# Altium project DCDC.PrjPcb (part 7 of 9)
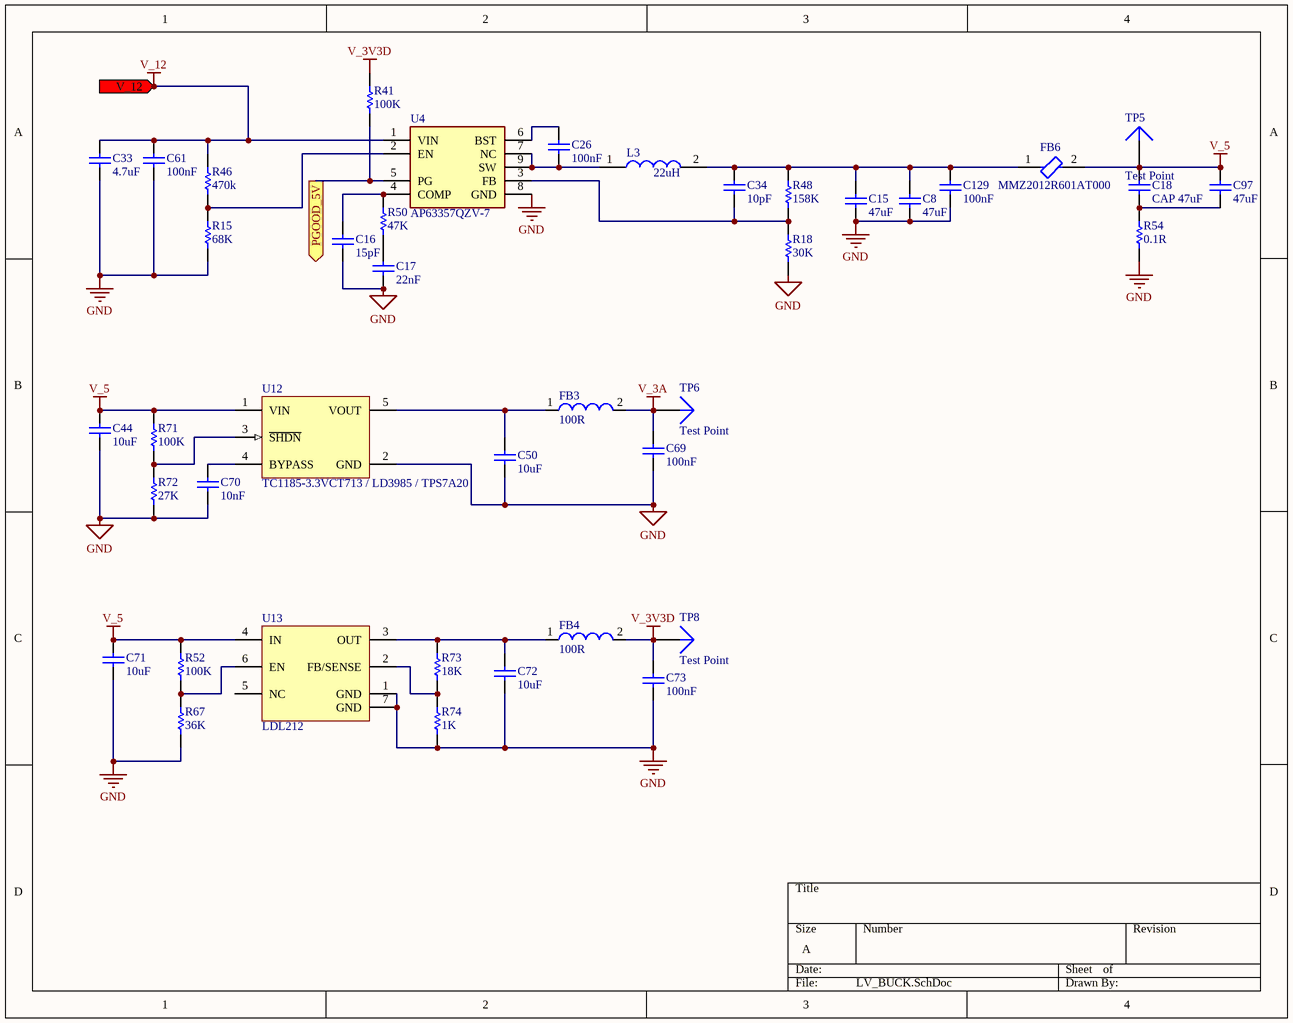
[diagram p13: LV_BUCK.SchDoc]

## Sheet LV_BUCK.SchDoc (continued)
### Library data of the parts
C8 C15 C97 = CAP: X5R 47uF ±20% 10V 1206 Multilayer Ceramic Capacitors MLCC - SMD/SMT ROHS; Manufacturer: Kyocera AVX; Manufacturer Part Number: 12066C226KAT2A; Tolerance: Â±10%; Case-EIA: 1206; Rated Voltage: 6.3 V; Value: 22uF; Case-Metric: 3216; Voltage Rating (DC): 6.3V; Dielectric: X7R; Dissipation Factor: 5%; Technology: SMT; Max Thickness: 1.9 mm; Supplier 1: Digi-Key; Supplier Part Number 1: 478-5997-1-ND; RoHS: Yes; Category: Ceramic Capacitors; Stock 1: 4915; Pricing 1: 1=0.81000, 10=0.57100, 100=0.37570, 500=0.27830, 1000=0.23656 (USD); Mount: Surface Mount; Case/Package: 1206; Number of Pins: 2; Case Code (Imperial): 1206; Case Code (Metric): 3216; Contact Plating: Tin,Matte; Min Operating Temperature: -55°C; Max Operating Temperature: 125°C; Capacitance: 47uF; Voltage Rating: 10V; Packaging: Tape and Reel; Package Quantity: 2500; Termination: SMD/SMT; Voltage: 6.3V; Length: 3.2mm; Height: 1.78mm; Width: 1.6mm; Depth: 1.6mm; Thickness: 0.07inch; Radiation Hardening: No; REACH SVHC: No SVHC; Lead Free: Lead Free; ComponentLink1URL: https://datasheet.ciiva.com/11786/0900766b80dc2409-11786266.pdf?src-supplier=RSComponents; ComponentLink1Description: https://datasheet.ciiva.com/11786/0900766b80dc2409-11786266.pdf?src-supplier=RSComponents; ComponentLink2URL: https://datasheet.ciiva.com/16315/cx7r-16315655.pdf?src-supplier=Future+Electronics; ComponentLink2Description: https://datasheet.ciiva.com/16315/cx7r-16315655.pdf?src-supplier=Future+Electronics; ComponentLink3URL: https://datasheet.ciiva.com/154/cx7r-154924.pdf?src-supplier=Digi-Key; ComponentLink3Description: https://datasheet.ciiva.com/154/cx7r-154924.pdf?src-supplier=Digi-Key; ComponentLink4URL: https://datasheet.ciiva.com/154/cx7r-154925.pdf?src-supplier=Digi-Key; ComponentLink4Description: https://datasheet.ciiva.com/154/cx7r-154925.pdf?src-supplier=Digi-Key; ComponentLink5URL: https://datasheet.ciiva.com/154/cx7r-154926.pdf?src-supplier=Digi-Key; ComponentLink5Description: https://datasheet.ciiva.com/154/cx7r-154926.pdf?src-supplier=Digi-Key; Parameter 1: *; JLCPCB Part #: C96123
C16 = CMP-1034-00812-2: C0G ±5% 15pF 50V 0402 Multilayer Ceramic Capacitors MLCC - SMD/SMT ROHS; Manufacturer: AVX Interconnect / Elco; Part Number: 04025A150FAT2A; Tolerance: 1%; Supplier 1: Digi-Key; Supplier Part Number 1: 478-5126-1-ND; Manufacturer Part Number: 04025A150FAT2A; RoHS: Yes; Category: Ceramic Capacitors; Stock 1: 101927; Pricing 1: 1=0.57000, 10=0.40100, 50=0.30300, 100=0.26390, 500=0.19550, 1000=0.16618, 2500=0.15640, 5000=0.14662 (USD); Mount: Surface Mount,PCB; Case/Package: 0402; Number of Pins: 2; Case Code (Metric): 1005; Case Code (Imperial): 0402; Dielectric Material: Ceramic; Min Operating Temperature: -55°C; Max Operating Temperature: 125°C; Package Quantity: 1; Capacitance: 15pF; Voltage Rating: 50V; Packaging: Tape and Reel; Voltage Rating (DC): 50V; Dielectric: C0G; Termination: SMD/SMT; Series: -; Construction: Flat; Voltage: 50V; Length: 1mm; Width: 0.02inch; Height: 0.56mm; Depth: 0.5mm; Thickness: 0.022inch; Radiation Hardening: No; REACH SVHC: No SVHC; Lead Free: Lead Free; RoHS Compliant: Yes; ComponentLink1URL: https://datasheet.ciiva.com/26927/getdatasheetpartid-379176-26927300.pdf?src-supplier=Verical; ComponentLink1Description: https://datasheet.ciiva.com/26927/getdatasheetpartid-379176-26927300.pdf?src-supplier=Verical; ComponentLink2URL: https://datasheet.ciiva.com/157/ccog-157986.pdf?src-supplier=Digi-Key; ComponentLink2Description: https://datasheet.ciiva.com/157/ccog-157986.pdf?src-supplier=Digi-Key; ComponentLink3URL: https://datasheet.ciiva.com/157/ccog-157987.pdf?src-supplier=Digi-Key; ComponentLink3Description: https://datasheet.ciiva.com/157/ccog-157987.pdf?src-supplier=Digi-Key; ComponentLink4URL: https://datasheet.ciiva.com/157/ccog-157988.pdf?src-supplier=Digi-Key; ComponentLink4Description: https://datasheet.ciiva.com/157/ccog-157988.pdf?src-supplier=Digi-Key; ComponentLink5URL: https://datasheet.ciiva.com/14603/70001039-14603477.pdf?src-supplier=Allied+Electronics; ComponentLink5Description: https://datasheet.ciiva.com/14603/70001039-14603477.pdf?src-supplier=Allied+Electronics; ComponentLink6URL: https://datasheet.ciiva.com/28453/1796416-28453769.pdf?src-supplier=Element14; ComponentLink6Description: https://datasheet.ciiva.com/28453/1796416-28453769.pdf?src-supplier=Element14; ComponentLink7URL: https://datasheet.ciiva.com/22619/1796416-22619722.pdf?src-supplier=Element14; ComponentLink7Description: https://datasheet.ciiva.com/22619/1796416-22619722.pdf?src-supplier=Element14; ComponentLink8URL: https://datasheet.ciiva.com/11568/ccog-11568587.pdf?src-supplier=Avnet; ComponentLink8Description: https://datasheet.ciiva.com/11568/ccog-11568587.pdf?src-supplier=Avnet; Parameter 1: *; JLCPCB Part #: C1548
C17 = CMP-2008-02925-1: X7R ±10% 50V 22nF 0402 Multilayer Ceramic Capacitors MLCC - SMD/SMT ROHS; Manufacturer: AVX Interconnect / Elco; Part Number: 04023C103JAT2A; Tolerance: 5%; Capacitance: 10nF; Voltage Rating: 25V; Supplier 1: Digi-Key; Supplier Part Number 1: 478-7867-1-ND; Manufacturer Part Number: 04023C103JAT2A; RoHS: Yes; Category: Ceramic Capacitors; Stock 1: 9321; Pricing 1: 1=0.35000, 10=0.24300, 50=0.16980, 100=0.14560, 500=0.10920, 1000=0.09221, 2500=0.08735, 5000=0.08250 (USD); Mount: Surface Mount; Case/Package: 0402; Number of Pins: 2; Case Code (Imperial): 0402; Case Code (Metric): 1005; Min Operating Temperature: -55°C; Max Operating Temperature: 125°C; Packaging: Tape and Reel; Package Quantity: 1; Voltage Rating (DC): 25V; Dielectric: X7R; Termination: SMD/SMT; Series: -; Construction: Flat; Length: 1mm; Width: 0.5mm; Thickness: 0.022inch; Depth: 0.5mm; Radiation Hardening: No; RoHS Compliant: Yes; Lead Free: Lead Free; ComponentLink1URL: https://datasheet.ciiva.com/11499/cx7r-11499815.pdf?src-supplier=Avnet; ComponentLink1Description: https://datasheet.ciiva.com/11499/cx7r-11499815.pdf?src-supplier=Avnet; ComponentLink2URL: https://datasheet.ciiva.com/5424/cx7r-218113-5424201.pdf?src-supplier=Mouser; ComponentLink2Description: https://datasheet.ciiva.com/5424/cx7r-218113-5424201.pdf?src-supplier=Mouser; ComponentLink3URL: https://datasheet.ciiva.com/7614/cx7r-7614730.pdf?src-supplier=Digi-Key; ComponentLink3Description: https://datasheet.ciiva.com/7614/cx7r-7614730.pdf?src-supplier=Digi-Key; ComponentLink4URL: https://datasheet.ciiva.com/208/cx7r-208205.pdf?src-supplier=Digi-Key; ComponentLink4Description: https://datasheet.ciiva.com/208/cx7r-208205.pdf?src-supplier=Digi-Key; ComponentLink5URL: https://datasheet.ciiva.com/14906/cx7r-14906237.pdf?src-supplier=Digi-Key; ComponentLink5Description: https://datasheet.ciiva.com/14906/cx7r-14906237.pdf?src-supplier=Digi-Key; ComponentLink6URL: https://datasheet.ciiva.com/16397/cx7r-16397645.pdf?src-supplier=Future+Electronics; ComponentLink6Description: https://datasheet.ciiva.com/16397/cx7r-16397645.pdf?src-supplier=Future+Electronics; ComponentLink7URL: https://datasheet.ciiva.com/14906/cx7r-14906238.pdf?src-supplier=Digi-Key; ComponentLink7Description: https://datasheet.ciiva.com/14906/cx7r-14906238.pdf?src-supplier=Digi-Key; Parameter 1: *; JLCPCB Part #: C1532
C18 = CMP-1038-02291-1: CAP 47uF 6.3V ±20% 1210 (3225 Metric) Thickness 2.8mm SMD; Tolerance: Â±20%; Case-EIA: 1210; Case-Metric: 3225; Technology: SMT; Rated Voltage: 6.3 V; Max Thickness: 2.8 mm; Value: 47uF; Parameter 1: *; JLCPCB Part #: *
C26 = CMP-2008-02800-1: X7R 100nF ±10% 16V 0402 Multilayer Ceramic Capacitors MLCC - SMD/SMT ROHS; Manufacturer: AVX Interconnect / Elco; Part Number: 0402YC104KAT2A; Supplier 1: Digi-Key; Supplier Part Number 1: 478-7888-1-ND; Manufacturer Part Number: 0402YC104KAT2A; RoHS: Yes; Category: Ceramic Capacitors; Stock 1: 72315; Pricing 1: 1=0.10000, 10=0.01600, 50=0.00860, 100=0.00700, 500=0.00500, 1000=0.00393, 2500=0.00358, 5000=0.00329 (USD); Mount: Surface Mount,PCB; Case/Package: 0402; Case Code (Metric): 1005; Case Code (Imperial): 0402; Dielectric Material: Ceramic; Contact Plating: Tin,Matte; Min Operating Temperature: -55°C; Max Operating Temperature: 125°C; Tolerance: 10%; Packaging: Tape and Reel; Capacitance: 100nF; Voltage Rating: 16V; Voltage Rating (DC): 16V; Dielectric: X7R; Voltage: 16V; Package Quantity: 1; Termination: SMD/SMT; Series: -; Construction: Flat; Length: 1mm; Width: 0.02inch; Height: 0.56mm; Thickness: 0.022inch; Depth: 0.5mm; Radiation Hardening: No; REACH SVHC: Unknown; RoHS Compliant: Yes; Lead Free: Lead Free; ComponentLink1URL: https://datasheet.ciiva.com/1123/1679506-1123956.pdf?src-supplier=Element14; ComponentLink1Description: https://datasheet.ciiva.com/1123/1679506-1123956.pdf?src-supplier=Element14; ComponentLink2URL: https://datasheet.ciiva.com/7614/cx7r-7614662.pdf?src-supplier=Digi-Key; ComponentLink2Description: https://datasheet.ciiva.com/7614/cx7r-7614662.pdf?src-supplier=Digi-Key; ComponentLink3URL: https://datasheet.ciiva.com/22693/1679506-22693578.pdf?src-supplier=Element14; ComponentLink3Description: https://datasheet.ciiva.com/22693/1679506-22693578.pdf?src-supplier=Element14; ComponentLink4URL: https://datasheet.ciiva.com/16623/cx7r-16623291.pdf?src-supplier=Avnet+Europe; ComponentLink4Description: https://datasheet.ciiva.com/16623/cx7r-16623291.pdf?src-supplier=Avnet+Europe; ComponentLink5URL: https://datasheet.ciiva.com/2987/cx7r-2987708.pdf?src-supplier=Avnet; ComponentLink5Description: https://datasheet.ciiva.com/2987/cx7r-2987708.pdf?src-supplier=Avnet; ComponentLink6URL: https://datasheet.ciiva.com/6265/cx7r-6265276.pdf?src-supplier=Digi-Key; ComponentLink6Description: https://datasheet.ciiva.com/6265/cx7r-6265276.pdf?src-supplier=Digi-Key; ComponentLink7URL: https://datasheet.ciiva.com/28613/1679506-28613260.pdf?src-supplier=Element14; ComponentLink7Description: https://datasheet.ciiva.com/28613/1679506-28613260.pdf?src-supplier=Element14; ComponentLink8URL: https://datasheet.ciiva.com/5411/cx7r-218113-5411197.pdf?src-supplier=Mouser; ComponentLink8Description: https://datasheet.ciiva.com/5411/cx7r-218113-5411197.pdf?src-supplier=Mouser; ComponentLink9URL: https://datasheet.ciiva.com/7709/1679506-7709566.pdf?src-supplier=Element14; ComponentLink9Description: https://datasheet.ciiva.com/7709/1679506-7709566.pdf?src-supplier=Element14; Parameter 1: *; JLCPCB Part #: C1525
C33 = CMP-2000-07581-1: X7R ±10% 50V 4.7uF 1206 Multilayer Ceramic Capacitors MLCC - SMD/SMT ROHS; Manufacturer: AVX; Manufacturer Part Number: 12065C475KAT2A; Case\/Package: 1206; Dissipation Factor: 2.5%; Case Code (Imperial): 1206; Tolerance: 10%; Radiation Hardening: No; Mount: SurfaceMount; Capacitance: 4.7uF; Voltage Rating: 50V; Width: 1.6mm; Manufacturer URL: http://www.avx.com/; RoHSCompliant: True; Thickness: 0.07inch; Depth: 1.6mm; Min Operating Temperature: -55degC; Package Reference: 1206; Voltage Rating (DC): 50V; Package Description: 2-Pin Surface Mount Device, Body 3.2 x 1.6 mm; Datasheet URL: http://datasheets.avx.com/X7RDielectric.pdf; Case Code (Metric): 3216; REACH SVHC: NoSVHC; Packaging: TapeandReel; Mounting Technology: SurfaceMount; Termination: SMD/SMT; Package Quantity: 1; Datasheet Version: 03/2017; Max Operating Temperature: 125degC; Contact Plating: Matte; Length: 3.2mm; Lead Free: LeadFree; Dielectric: X7R; Supplier 1: Digi-Key; Supplier Part Number 1: 478-6653-1-ND; RoHS: Yes; Category: Ceramic Capacitors; Stock 1: 241833; Pricing 1: 1=0.51000, 10=0.35400, 100=0.21250, 500=0.15940, 1000=0.13460 (USD); Case/Package: 1206; ComponentLink1URL: https://datasheet.ciiva.com/5410/cx7r-218113-5410549.pdf?src-supplier=Mouser; ComponentLink1Description: https://datasheet.ciiva.com/5410/cx7r-218113-5410549.pdf?src-supplier=Mouser; ComponentLink2URL: https://datasheet.ciiva.com/16387/flexiterm-16387141.pdf?src-supplier=Future+Electronics; ComponentLink2Description: https://datasheet.ciiva.com/16387/flexiterm-16387141.pdf?src-supplier=Future+Electronics; ComponentLink3URL: https://datasheet.ciiva.com/153/cx7r-153750.pdf?src-supplier=Digi-Key; ComponentLink3Description: https://datasheet.ciiva.com/153/cx7r-153750.pdf?src-supplier=Digi-Key; ComponentLink4URL: https://datasheet.ciiva.com/7833/cx7r-7833462.pdf?src-supplier=Element14; ComponentLink4Description: https://datasheet.ciiva.com/7833/cx7r-7833462.pdf?src-supplier=Element14; ComponentLink5URL: https://datasheet.ciiva.com/153/cx7r-153751.pdf?src-supplier=Digi-Key; ComponentLink5Description: https://datasheet.ciiva.com/153/cx7r-153751.pdf?src-supplier=Digi-Key; ComponentLink6URL: https://datasheet.ciiva.com/7833/cx7r-7833463.pdf?src-supplier=Element14; ComponentLink6Description: https://datasheet.ciiva.com/7833/cx7r-7833463.pdf?src-supplier=Element14; ComponentLink7URL: https://datasheet.ciiva.com/153/cx7r-153752.pdf?src-supplier=Digi-Key; ComponentLink7Description: https://datasheet.ciiva.com/153/cx7r-153752.pdf?src-supplier=Digi-Key; Parameter 1: *; JLCPCB Part #: C29823
C34 = CMP-2008-02563-1: C0G ±5% 10pF 50V 0402 Multilayer Ceramic Capacitors MLCC - SMD/SMT ROHS; Part Number: 04025A100DAT2A; Manufacturer: AVX Interconnect / Elco; Temperature Coefficient: 30ppm/°C; Supplier 1: Digi-Key; Supplier Part Number 1: 478-7870-1-ND; Manufacturer Part Number: 04025A100DAT2A; RoHS: Yes; Category: Ceramic Capacitors; Stock 1: 172687; Pricing 1: 1=0.30000, 10=0.20700, 50=0.13800, 100=0.11730, 500=0.08280, 1000=0.07245, 2500=0.06900, 5000=0.06382 (USD); Mount: Surface Mount; Case/Package: 0402; Number of Pins: 2; Case Code (Metric): 1005; Case Code (Imperial): 0402; Dielectric Material: Ceramic; Contact Plating: Tin,Matte; Min Operating Temperature: -55°C; Max Operating Temperature: 125°C; Capacitance: 10pF; Voltage Rating: 50V; Voltage Rating (DC): 50V; Package Quantity: 1; Packaging: Tape and Reel; Dielectric: C0G; Termination: SMD/SMT; Series: -; Tolerance: 5%; Construction: Flat; Voltage: 50V; Length: 1mm; Width: 0.02inch; Height: 0.56mm; Depth: 0.5mm; Thickness: 0.022inch; Radiation Hardening: No; RoHS Compliant: Yes; REACH SVHC: No SVHC; Lead Free: Lead Free; ComponentLink1URL: https://datasheet.ciiva.com/11788/0900766b80def0e2-11788539.pdf?src-supplier=RSComponents; ComponentLink1Description: https://datasheet.ciiva.com/11788/0900766b80def0e2-11788539.pdf?src-supplier=RSComponents; ComponentLink2URL: https://datasheet.ciiva.com/2990/ccog-2990165.pdf?src-supplier=Avnet; ComponentLink2Description: https://datasheet.ciiva.com/2990/ccog-2990165.pdf?src-supplier=Avnet; ComponentLink3URL: https://datasheet.ciiva.com/16623/ccog-16623350.pdf?src-supplier=Avnet+Europe; ComponentLink3Description: https://datasheet.ciiva.com/16623/ccog-16623350.pdf?src-supplier=Avnet+Europe; ComponentLink4URL: https://datasheet.ciiva.com/14906/ccog-14906265.pdf?src-supplier=Digi-Key; ComponentLink4Description: https://datasheet.ciiva.com/14906/ccog-14906265.pdf?src-supplier=Digi-Key; ComponentLink5URL: https://datasheet.ciiva.com/206/ccog-206459.pdf?src-supplier=Digi-Key; ComponentLink5Description: https://datasheet.ciiva.com/206/ccog-206459.pdf?src-supplier=Digi-Key; ComponentLink6URL: https://datasheet.ciiva.com/14906/ccog-14906267.pdf?src-supplier=Digi-Key; ComponentLink6Description: https://datasheet.ciiva.com/14906/ccog-14906267.pdf?src-supplier=Digi-Key; ComponentLink7URL: https://datasheet.ciiva.com/1123/ccog-1123468.pdf?src-supplier=Element14; ComponentLink7Description: https://datasheet.ciiva.com/1123/ccog-1123468.pdf?src-supplier=Element14; ComponentLink8URL: https://datasheet.ciiva.com/1123/ccog-1123469.pdf?src-supplier=Element14; ComponentLink8Description: https://datasheet.ciiva.com/1123/ccog-1123469.pdf?src-supplier=Element14; Parameter 1: *; JLCPCB Part #: C32949
C44 C50 C71 C72 = CMP-2007-03395-1: X5R 25V ±10% 10uF 0805 Multilayer Ceramic Capacitors MLCC - SMD/SMT ROHS; Part Number: GRM21BR71A106KE51L; Manufacturer: Murata; Parameter 1: *; JLCPCB Part #: C15850
C61 C69 C73 = CAP: X7R 100nF ±10% 50V 0603 Multilayer Ceramic Capacitors MLCC - SMD/SMT ROHS; Part Number: GCM188R72A104KA64D; Manufacturer: Murata; Manufacturer Part Number: CC0603KRX7R9BB104; Voltage Rating: 100V; Supplier 1: Arrow Electronics; Supplier Part Number 1: GCM188R72A104KA64D; RoHS: Yes; Category: Ceramic Capacitors; Mount: Surface Mount; Case/Package: 0603; Case Code (Imperial): 0603; Case Code (Metric): 1608; Min Operating Temperature: -55°C; Max Operating Temperature: 125°C; Tolerance: 10%; Packaging: Tape and Reel; Capacitance: 100nF; Dielectric: X7R; Termination: SMD/SMT; Voltage Rating (DC): 100V; Length: 1.6mm; Height: 0.8mm; Depth: 0.8mm; Radiation Hardening: No; ComponentLink1URL: https://datasheet.ciiva.com/17451/product-17451047.pdf?src-supplier=Avnet+Europe; ComponentLink1Description: https://datasheet.ciiva.com/17451/product-17451047.pdf?src-supplier=Avnet+Europe; ComponentLink2URL: https://datasheet.ciiva.com/26889/getdatasheetpartid-387765-26889164.pdf?src-supplier=Verical; ComponentLink2Description: https://datasheet.ciiva.com/26889/getdatasheetpartid-387765-26889164.pdf?src-supplier=Verical; Parameter 1: *; JLCPCB Part #: C14663
C70 = CMP-2006-02924-1: X7R ±10% 50V 10nF 0603 Multilayer Ceramic Capacitors MLCC - SMD/SMT ROHS; Part Number: GRM188R71H472KA01D; Manufacturer: Murata; Capacitance: 4.7nF; Insulation Resistance: 10GR; Supplier 1: Farnell; Supplier Part Number 1: 1118177; Manufacturer Part Number: GRM188R71H472KA01D; RoHS: Yes; Category: Ceramic Capacitors; Pricing 1: 1=19.92000, 3=19.13000 (GBP); Mount: Surface Mount; Case/Package: 0603; Number of Pins: 2; Case Code (Imperial): 0603; Case Code (Metric): 1608; Dielectric Material: Ceramic; Material: Ceramic; Min Operating Temperature: -55°C; Max Operating Temperature: 125°C; Voltage Rating (DC): 50V; Tolerance: 10%; Packaging: Tape and Reel; Dielectric: X7R; Series: GRM; Voltage Rating: 50V; Package Quantity: 1; Termination: SMD/SMT; Voltage: 50V; Length: 1.6mm; Width: 0.8mm; Height: 0.8mm; Depth: 0.8mm; Thickness: 0.035inch; Radiation Hardening: No; RoHS Compliant: Yes; REACH SVHC: No SVHC; Lead Free: Lead Free; ComponentLink1URL: https://datasheet.ciiva.com/5412/product-5412608.pdf?src-supplier=Mouser; ComponentLink1Description: https://datasheet.ciiva.com/5412/product-5412608.pdf?src-supplier=Mouser; ComponentLink2URL: https://datasheet.ciiva.com/18102/getdatasheetpartid-75298-18102657.pdf?src-supplier=Verical; ComponentLink2Description: https://datasheet.ciiva.com/18102/getdatasheetpartid-75298-18102657.pdf?src-supplier=Verical; ComponentLink3URL: https://datasheet.ciiva.com/11787/0900766b8003061f-11787116.pdf?src-supplier=RSComponents; ComponentLink3Description: https://datasheet.ciiva.com/11787/0900766b8003061f-11787116.pdf?src-supplier=RSComponents; ComponentLink4URL: https://datasheet.ciiva.com/29201/451888-da-01-en-vs-kondensator-0603-29201828.pdf?src-supplier=Conrad; ComponentLink4Description: https://datasheet.ciiva.com/29201/451888-da-01-en-vs-kondensator-0603-29201828.pdf?src-supplier=Conrad; ComponentLink5URL: https://datasheet.ciiva.com/7937/4360-7937669.pdf?src-supplier=Element14; ComponentLink5Description: https://datasheet.ciiva.com/7937/4360-7937669.pdf?src-supplier=Element14; ComponentLink6URL: https://datasheet.ciiva.com/48428/nmgrm-data-en-48428597.pdf?src-supplier=Distrelec; ComponentLink6Description: https://datasheet.ciiva.com/48428/nmgrm-data-en-48428597.pdf?src-supplier=Distrelec; ComponentLink7URL: https://datasheet.ciiva.com/7937/4360-7937670.pdf?src-supplier=Element14; ComponentLink7Description: https://datasheet.ciiva.com/7937/4360-7937670.pdf?src-supplier=Element14; ComponentLink8URL: https://datasheet.ciiva.com/7937/4360-7937671.pdf?src-supplier=Element14; ComponentLink8Description: https://datasheet.ciiva.com/7937/4360-7937671.pdf?src-supplier=Element14; ComponentLink9URL: https://datasheet.ciiva.com/130/partnumbering-e-01-130733.pdf?src-supplier=Digi-Key; ComponentLink9Description: https://datasheet.ciiva.com/130/partnumbering-e-01-130733.pdf?src-supplier=Digi-Key; ComponentLink10URL: https://datasheet.ciiva.com/130/partnumbering-e-01-130734.pdf?src-supplier=Digi-Key; ComponentLink10Description: https://datasheet.ciiva.com/130/partnumbering-e-01-130734.pdf?src-supplier=Digi-Key; ComponentLink11URL: https://datasheet.ciiva.com/130/partnumbering-e-01-130735.pdf?src-supplier=Digi-Key; ComponentLink11Description: https://datasheet.ciiva.com/130/partnumbering-e-01-130735.pdf?src-supplier=Digi-Key; JLCPCB Part #: C57112
C129 = CAP: X7R 100nF ±10% 16V 0402 Multilayer Ceramic Capacitors MLCC - SMD/SMT ROHS; Manufacturer: AVX Interconnect / Elco; Part Number: 04026D104KAT2A; Voltage Rating: 6.3V; Dielectric: X5R; Supplier 1: Newark; Supplier Part Number 1: 34M9214; Manufacturer Part Number: 04026D104KAT2A; RoHS: Yes; Category: Ceramic Capacitors; Stock 1: 1436; Pricing 1: 10=0.02800, 25=0.02300, 50=0.01800, 100=0.01200, 250=0.01100, 500=0.00900, 1000=0.00700 (USD); Mount: Surface Mount; Case/Package: 0402; Case Code (Metric): 1005; Case Code (Imperial): 0402; Contact Plating: Tin,Matte; Dielectric Material: Ceramic; Min Operating Temperature: -55°C; Max Operating Temperature: 85°C; Package Quantity: 1; Packaging: Tape and Reel; Capacitance: 100nF; Tolerance: 10%; Voltage Rating (DC): 6.3V; Voltage: 6.3V; Termination: SMD/SMT; Series: -; Construction: Flat; Length: 1mm; Width: 0.02inch; Height: 0.56mm; Thickness: 0.022inch; Depth: 0.5mm; Radiation Hardening: No; REACH SVHC: No SVHC; Lead Free: Lead Free; RoHS Compliant: Yes; Parameter 1: *; JLCPCB Part #: C1525
FB3 FB4 = CMP-0220-00115-1: SMD EMI Suppression Ferrite Bead WE-CBF, Z = 1500 Ohm; DatasheetVersion: Dec-2005; ComponentLink1URL: http://www.we-online.com; PackageVersion: 2009; PackageDescription: Chip Inductor, 2-Leads, Body 1.6 x 0.8 mm; ComponentLink2URL: http://www.we-online.de/katalog/media/pdf/742792691.pdf; ComponentLink1Description: Manufacturer Link; ComponentLink2Description: Datasheet; Impedance: 1500 Ohm; PackageReference: SMD-0603; Parameter 1: *; JLCPCB Part #: *
FB6 = CMP-08257-000163-1: Signal Line Ferrite Bead 600Ω @ 100Mhz 500mA DCR 200mΩ SMD 0805; DC Resistance (DCR): 200mR; Tolerance: 25%; Impedance: 600R; Case/Package: 0805; Max DC Current: 500mA; RoHS Compliant: Yes; Mount: Surface Mount; Current Rating: 500mA; Case Code (Metric): 2012; Number of Pins: 2; Package Quantity: 1; Series: MMZ; Packaging: Cut Tape; Depth: 1.25mm; Width: 0.049inch; Length: 0.079inch; Case Code (Imperial): 0805; Height: 0.041inch; Core Material: Ferrite; REACH SVHC: No SVHC; Parameter 1: *; JLCPCB Part #: *
L3 = MPX1D0840L470: Inductor 22uH; Manufacturer_Name: Kemet; Manufacturer_Part_Number: MPX1D0840L220; Datasheet Link: https://componentsearchengine.com/Datasheets/1/MPX1D0840L470.pdf; Height: 4mm; Mouser Part Number: 80-MPX1D0840L220; Mouser Price/Stock: https://www.mouser.com/Search/Refine.aspx?Keyword=80-MPX1D0840L470; Parameter 1: *; JLCPCB Part #: *
R15 = CMP-2002-00968-1: 1/16W ±1% ±100ppm/℃ 68kΩ 0402 Chip Resistor - Surface Mount ROHS; Part Number: ERJ-2RKF4993X; Manufacturer: Panasonic; Resistance: 499kR; Temperature Coefficient: 100ppm/°C; Power Rating: 100mW; Voltage Rating: 50V; Supplier 1: Digi-Key; Supplier Part Number 1: P499KLCT-ND; Manufacturer Part Number: ERJ-2RKF4993X; RoHS: Yes; Category: Chip SMD Resistors; Stock 1: 131008; Pricing 1: 1=0.10000, 10=0.04000, 100=0.01620, 1000=0.00729, 2500=0.00632, 5000=0.00523 (USD); Mount: Surface Mount; Case/Package: 0402; Weight: 2.8E-05oz; Case Code (Imperial): 0402; Case Code (Metric): 1005; Contact Plating: Tin; Min Operating Temperature: -55°C; Max Operating Temperature: 155°C; Tolerance: 1%; Packaging: Tape and Reel; Composition: Thick Film; Package Quantity: 1; Termination: SMD/SMT; Number of Terminations: 2; Max Power Dissipation: 100mW; Voltage Rating (DC): 50V; Features: Automotive AEC-Q200; Military Standard: Not; Length: 1mm; Height: 0.016inch; Width: 0.5mm; Depth: 0.5mm; Lead Free: Lead Free; REACH SVHC: Unknown; ComponentLink1URL: https://datasheet.ciiva.com/28610/1678782-28610966.pdf?src-supplier=Element14; ComponentLink1Description: https://datasheet.ciiva.com/28610/1678782-28610966.pdf?src-supplier=Element14; ComponentLink2URL: https://datasheet.ciiva.com/24163/aoa0000ce2-24163576.pdf?src-supplier=Mouser; ComponentLink2Description: https://datasheet.ciiva.com/24163/aoa0000ce2-24163576.pdf?src-supplier=Mouser; ComponentLink3URL: https://datasheet.ciiva.com/9181/aoa0000ce2-9181513.pdf?src-supplier=Avnet; ComponentLink3Description: https://datasheet.ciiva.com/9181/aoa0000ce2-9181513.pdf?src-supplier=Avnet; ComponentLink4URL: https://datasheet.ciiva.com/5951/426256-5951322.pdf?src-supplier=Farnell; ComponentLink4Description: https://datasheet.ciiva.com/5951/426256-5951322.pdf?src-supplier=Farnell; ComponentLink5URL: https://datasheet.ciiva.com/43460/426256-43460346.pdf?src-supplier=Farnell; ComponentLink5Description: https://datasheet.ciiva.com/43460/426256-43460346.pdf?src-supplier=Farnell; ComponentLink6URL: https://datasheet.ciiva.com/9181/aoa0000ce2-9181509.pdf?src-supplier=Avnet; ComponentLink6Description: https://datasheet.ciiva.com/9181/aoa0000ce2-9181509.pdf?src-supplier=Avnet; ComponentLink7URL: https://datasheet.ciiva.com/28672/1678782-28672345.pdf?src-supplier=Element14; ComponentLink7Description: https://datasheet.ciiva.com/28672/1678782-28672345.pdf?src-supplier=Element14; ComponentLink8URL: https://datasheet.ciiva.com/46377/426256-46377753.pdf?src-supplier=Element14; ComponentLink8Description: https://datasheet.ciiva.com/46377/426256-46377753.pdf?src-supplier=Element14; ComponentLink9URL: https://datasheet.ciiva.com/16760/70260748-16760715.pdf?src-supplier=Allied+Electronics; ComponentLink9Description: https://datasheet.ciiva.com/16760/70260748-16760715.pdf?src-supplier=Allied+Electronics; Parameter 1: *; JLCPCB Part #: C36871
R18 = CMP-1011-00675-2: Res Thick Film 0402 30K Ohm 1% 0.063W(1/16W) ±100ppm/C Molded SMD Automotive Paper T/R; Part Number: CRCW040230K0FKED; Manufacturer: Vishay Dale; Resistance: 30kR; Power Rating: 63mW; Temperature Coefficient: 100ppm/°C; Voltage Rating: 50V; Supplier 1: RSComponents; Supplier Part Number 1: 6789140; Manufacturer Part Number: CRCW040230K0FKED; RoHS: Yes; Category: Chip SMD Resistors; Stock 1: 19350; Pricing 1: 50=0.04000, 500=0.01600, 1250=0.00800 (USD); Mount: Surface Mount; Case/Package: 0402; Number of Pins: 2; Case Code (Imperial): 0402; Case Code (Metric): 1005; Weight: 2.3E-05oz; Contact Plating: Tin; Size Code: 0402; Min Operating Temperature: -55°C; Max Operating Temperature: 155°C; Tolerance: 1%; Packaging: Tape and Reel; Resistor Type: Thick Film; Number of Terminations: 2; Series: CRCW; Max Power Dissipation: 63mW; Voltage Rating (DC): 50V; Package Quantity: 10000; Termination: SMD/SMT; Construction: Rectangular; Resistance Tolerance: 1%; Features: Automotive AEC-Q200; Technology: THICK FILM; Length: 1mm; Width: 0.5mm; Height: 0.35mm; Depth: 0.5mm; Radiation Hardening: No; RoHS Compliant: Yes; Military Standard: Not; Lead Free: Lead Free; REACH SVHC: Unknown; ComponentLink1URL: https://datasheet.ciiva.com/11811/0900766b80d98824-11811264.pdf?src-supplier=RSComponents; ComponentLink1Description: https://datasheet.ciiva.com/11811/0900766b80d98824-11811264.pdf?src-supplier=RSComponents; ComponentLink2URL: https://datasheet.ciiva.com/7673/1697337-7673253.pdf?src-supplier=Element14; ComponentLink2Description: https://datasheet.ciiva.com/7673/1697337-7673253.pdf?src-supplier=Element14; ComponentLink3URL: https://datasheet.ciiva.com/2464/dcrcwe3-2464534.pdf?src-supplier=Digi-Key; ComponentLink3Description: https://datasheet.ciiva.com/2464/dcrcwe3-2464534.pdf?src-supplier=Digi-Key; ComponentLink4URL: https://datasheet.ciiva.com/7673/1697337-7673254.pdf?src-supplier=Element14; ComponentLink4Description: https://datasheet.ciiva.com/7673/1697337-7673254.pdf?src-supplier=Element14; ComponentLink5URL: https://datasheet.ciiva.com/2464/dcrcwe3-2464535.pdf?src-supplier=Digi-Key; ComponentLink5Description: https://datasheet.ciiva.com/2464/dcrcwe3-2464535.pdf?src-supplier=Digi-Key; ComponentLink6URL: https://datasheet.ciiva.com/2464/dcrcwe3-2464536.pdf?src-supplier=Digi-Key; ComponentLink6Description: https://datasheet.ciiva.com/2464/dcrcwe3-2464536.pdf?src-supplier=Digi-Key; ComponentLink7URL: https://datasheet.ciiva.com/16886/dcrcwe3-16886248.pdf?src-supplier=Avnet+Europe; ComponentLink7Description: https://datasheet.ciiva.com/16886/dcrcwe3-16886248.pdf?src-supplier=Avnet+Europe; ComponentLink8URL: https://datasheet.ciiva.com/3256/dcrcwe3-3256380.pdf?src-supplier=Avnet; ComponentLink8Description: https://datasheet.ciiva.com/3256/dcrcwe3-3256380.pdf?src-supplier=Avnet; ComponentLink9URL: https://datasheet.ciiva.com/22702/1697337-22702876.pdf?src-supplier=Element14; ComponentLink9Description: https://datasheet.ciiva.com/22702/1697337-22702876.pdf?src-supplier=Element14; ComponentLink10URL: https://datasheet.ciiva.com/16784/70201119-16784286.pdf?src-supplier=Allied+Electronics; ComponentLink10Description: https://datasheet.ciiva.com/16784/70201119-16784286.pdf?src-supplier=Allied+Electronics; Parameter 1: *; JLCPCB Part #: *
R41 = CMP-2002-07343-1: 1/16W ±1% ±100ppm/℃ 100kΩ 0402 Chip Resistor - Surface Mount ROHS; Part Number: RC0402FR-07100KL; Manufacturer: Yageo / Phycomp; Power Rating: 63mW; Resistance: 100kR; Temperature Coefficient: 100ppm/°C; Voltage Rating: 50V; Supplier 1: Digi-Key; Supplier Part Number 1: 311-100KLRCT-ND; Manufacturer Part Number: RC0402FR-07100KL; RoHS: Yes; Category: Chip SMD Resistors; Stock 1: 17727422; Pricing 1: 1=0.10000, 10=0.01600, 100=0.00640, 1000=0.00286, 2500=0.00248, 5000=0.00205 (USD); Case/Package: 0402; Case Code (Metric): 1005; Case Code (Imperial): 0402; Min Operating Temperature: -55°C; Max Operating Temperature: 155°C; Tolerance: 1%; Packaging: Tape and Reel; Max Power Dissipation: 63mW; Series: RC; Package Quantity: 1; Termination: SMD/SMT; Resistance Tolerance: 1%; Resistor Type: Thick Film; Number of Terminations: 2; Construction: Rectangular; Features: Moisture Resistant; Technology: THICK FILM; Working Voltage: 50V; Length: 0.039inch; Width: 0.02inch; Height: 0.016inch; Depth: 0.5mm; RoHS Compliant: Yes; REACH SVHC: No SVHC; Military Standard: Not; Lead Free: Lead Free; ComponentLink1URL: https://datasheet.ciiva.com/11819/0900766b80c66297-11819452.pdf?src-supplier=RSComponents; ComponentLink1Description: https://datasheet.ciiva.com/11819/0900766b80c66297-11819452.pdf?src-supplier=RSComponents; ComponentLink2URL: https://datasheet.ciiva.com/2453/pyu-r-int-thick-7-2453361.pdf?src-supplier=Digi-Key; ComponentLink2Description: https://datasheet.ciiva.com/2453/pyu-r-int-thick-7-2453361.pdf?src-supplier=Digi-Key; ComponentLink3URL: https://datasheet.ciiva.com/2453/pyu-r-int-thick-7-2453362.pdf?src-supplier=Digi-Key; ComponentLink3Description: https://datasheet.ciiva.com/2453/pyu-r-int-thick-7-2453362.pdf?src-supplier=Digi-Key; ComponentLink4URL: https://datasheet.ciiva.com/2453/pyu-r-int-thick-7-2453363.pdf?src-supplier=Digi-Key; ComponentLink4Description: https://datasheet.ciiva.com/2453/pyu-r-int-thick-7-2453363.pdf?src-supplier=Digi-Key; ComponentLink5URL: https://datasheet.ciiva.com/22747/1018594-22747509.pdf?src-supplier=Element14; ComponentLink5Description: https://datasheet.ciiva.com/22747/1018594-22747509.pdf?src-supplier=Element14; ComponentLink6URL: https://datasheet.ciiva.com/15189/getdatasheetpartid-323696-15189334.pdf?src-supplier=Verical; ComponentLink6Description: https://datasheet.ciiva.com/15189/getdatasheetpartid-323696-15189334.pdf?src-supplier=Verical; ComponentLink7URL: https://datasheet.ciiva.com/12667/pyu-rc0402-51-rohs-l-6-r-12667930.pdf?src-supplier=Mouser; ComponentLink7Description: https://datasheet.ciiva.com/12667/pyu-rc0402-51-rohs-l-6-r-12667930.pdf?src-supplier=Mouser; Parameter 1: *; JLCPCB Part #: C25741
R46 = CMP-2002-00968-1: ±1% 1/16W 470kΩ ±100ppm/℃ 0402 Chip Resistor - Surface Mount ROHS; Part Number: ERJ-2RKF4993X; Manufacturer: Panasonic; Resistance: 499kR; Temperature Coefficient: 100ppm/°C; Power Rating: 100mW; Voltage Rating: 50V; Supplier 1: Digi-Key; Supplier Part Number 1: P499KLCT-ND; Manufacturer Part Number: ERJ-2RKF4993X; RoHS: Yes; Category: Chip SMD Resistors; Stock 1: 131008; Pricing 1: 1=0.10000, 10=0.04000, 100=0.01620, 1000=0.00729, 2500=0.00632, 5000=0.00523 (USD); Mount: Surface Mount; Case/Package: 0402; Weight: 2.8E-05oz; Case Code (Imperial): 0402; Case Code (Metric): 1005; Contact Plating: Tin; Min Operating Temperature: -55°C; Max Operating Temperature: 155°C; Tolerance: 1%; Packaging: Tape and Reel; Composition: Thick Film; Package Quantity: 1; Termination: SMD/SMT; Number of Terminations: 2; Max Power Dissipation: 100mW; Voltage Rating (DC): 50V; Features: Automotive AEC-Q200; Military Standard: Not; Length: 1mm; Height: 0.016inch; Width: 0.5mm; Depth: 0.5mm; Lead Free: Lead Free; REACH SVHC: Unknown; ComponentLink1URL: https://datasheet.ciiva.com/28610/1678782-28610966.pdf?src-supplier=Element14; ComponentLink1Description: https://datasheet.ciiva.com/28610/1678782-28610966.pdf?src-supplier=Element14; ComponentLink2URL: https://datasheet.ciiva.com/24163/aoa0000ce2-24163576.pdf?src-supplier=Mouser; ComponentLink2Description: https://datasheet.ciiva.com/24163/aoa0000ce2-24163576.pdf?src-supplier=Mouser; ComponentLink3URL: https://datasheet.ciiva.com/9181/aoa0000ce2-9181513.pdf?src-supplier=Avnet; ComponentLink3Description: https://datasheet.ciiva.com/9181/aoa0000ce2-9181513.pdf?src-supplier=Avnet; ComponentLink4URL: https://datasheet.ciiva.com/5951/426256-5951322.pdf?src-supplier=Farnell; ComponentLink4Description: https://datasheet.ciiva.com/5951/426256-5951322.pdf?src-supplier=Farnell; ComponentLink5URL: https://datasheet.ciiva.com/43460/426256-43460346.pdf?src-supplier=Farnell; ComponentLink5Description: https://datasheet.ciiva.com/43460/426256-43460346.pdf?src-supplier=Farnell; ComponentLink6URL: https://datasheet.ciiva.com/9181/aoa0000ce2-9181509.pdf?src-supplier=Avnet; ComponentLink6Description: https://datasheet.ciiva.com/9181/aoa0000ce2-9181509.pdf?src-supplier=Avnet; ComponentLink7URL: https://datasheet.ciiva.com/28672/1678782-28672345.pdf?src-supplier=Element14; ComponentLink7Description: https://datasheet.ciiva.com/28672/1678782-28672345.pdf?src-supplier=Element14; ComponentLink8URL: https://datasheet.ciiva.com/46377/426256-46377753.pdf?src-supplier=Element14; ComponentLink8Description: https://datasheet.ciiva.com/46377/426256-46377753.pdf?src-supplier=Element14; ComponentLink9URL: https://datasheet.ciiva.com/16760/70260748-16760715.pdf?src-supplier=Allied+Electronics; ComponentLink9Description: https://datasheet.ciiva.com/16760/70260748-16760715.pdf?src-supplier=Allied+Electronics; Parameter 1: *; JLCPCB Part #: C25790
R48 = CMP-2002-00386-1: RES SMD 158K OHM 1% 1/16W 0402; Manufacturer: Vishay Dale; Part Number: CRCW0402158KFKTD; Resistance: 158kR; Temperature Coefficient: 100ppm/°C; Power Rating: 63mW; Voltage Rating: 50V; Supplier 1: Avnet; Supplier Part Number 1: CRCW0402158KFKTD; Manufacturer Part Number: CRCW0402158KFKTD; RoHS: No; Category: Chip SMD Resistors; Stock 1: 10000; Pricing 1: 10000=0.02620, 20000=0.02556, 40000=0.02520, 60000=0.02448, 80000=0.02394, 100000=0.02340, 1000000=0.02286 (USD); Case/Package: 0402; Number of Pins: 2; Case Code (Metric): 1005; Case Code (Imperial): 0402; Contact Plating: Tin,Lead; Weight: 2.3E-05oz; Min Operating Temperature: -55°C; Max Operating Temperature: 155°C; Packaging: Tape and Reel; Tolerance: 1%; Resistor Type: Thick Film; Package Quantity: 10000; Number of Terminations: 2; Termination: SMD/SMT; Max Power Dissipation: 63mW; Series: CRCW; Voltage Rating (DC): 50V; Features: Automotive AEC-Q200; Resistance Tolerance: 1%; Length: 0.039inch; Width: 0.02inch; Height: 0.016inch; Radiation Hardening: No; RoHS Compliant: No; Lead Free: Contains Lead; REACH SVHC: Unknown; ComponentLink1URL: https://datasheet.ciiva.com/8967/dcrcw-8967692.pdf?src-supplier=Avnet; ComponentLink1Description: https://datasheet.ciiva.com/8967/dcrcw-8967692.pdf?src-supplier=Avnet; ComponentLink2URL: https://datasheet.ciiva.com/2563/dcrcw-2563087.pdf?src-supplier=Digi-Key; ComponentLink2Description: https://datasheet.ciiva.com/2563/dcrcw-2563087.pdf?src-supplier=Digi-Key; Parameter 1: *; JLCPCB Part #: *
R50 = CMP-2002-08626-1: 1/16W ±1% ±100ppm/℃ 47kΩ 0402 Chip Resistor - Surface Mount ROHS; Part Number: CRCW040242K2FKED; Manufacturer: Vishay Dale; Resistance: 42.2kR; Temperature Coefficient: 100ppm/°C; Power Rating: 63mW; Voltage Rating: 50V; Supplier 1: Newark; Supplier Part Number 1: 52K7062; Manufacturer Part Number: CRCW040242K2FKED; RoHS: Yes; Category: Chip SMD Resistors; Stock 1: 19822; Pricing 1: 1=0.00500, 25=0.00500, 100=0.00500, 250=0.00500, 500=0.00500, 1000=0.00400 (USD); Case/Package: 0402; Number of Pins: 2; Case Code (Metric): 1005; Case Code (Imperial): 0402; Contact Plating: Tin; Weight: 2.3E-05oz; Size Code: 0402; Min Operating Temperature: -55°C; Max Operating Temperature: 155°C; Packaging: Tape and Reel; Tolerance: 1%; Resistor Type: Thick Film; Voltage Rating (DC): 50V; Series: CRCW; Number of Terminations: 2; Max Power Dissipation: 63mW; Package Quantity: 10; Termination: SMD/SMT; Features: Automotive AEC-Q200; Construction: Rectangular; Resistance Tolerance: 1%; Technology: THICK FILM; Length: 1mm; Width: 0.02inch; Height: 0.35mm; Depth: 0.5mm; Radiation Hardening: No; RoHS Compliant: Yes; Lead Free: Lead Free; REACH SVHC: Unknown; Military Standard: Not; ComponentLink1URL: https://datasheet.ciiva.com/3882/41397335s9853079n6892-3882805.pdf?src-supplier=Arrow+Electronics; ComponentLink1Description: https://datasheet.ciiva.com/3882/41397335s9853079n6892-3882805.pdf?src-supplier=Arrow+Electronics; ComponentLink2URL: https://datasheet.ciiva.com/11818/0900766b80d98824-11818095.pdf?src-supplier=RSComponents; ComponentLink2Description: https://datasheet.ciiva.com/11818/0900766b80d98824-11818095.pdf?src-supplier=RSComponents; ComponentLink3URL: https://datasheet.ciiva.com/2494/dcrcwe3-2494976.pdf?src-supplier=Digi-Key; ComponentLink3Description: https://datasheet.ciiva.com/2494/dcrcwe3-2494976.pdf?src-supplier=Digi-Key; ComponentLink4URL: https://datasheet.ciiva.com/2494/dcrcwe3-2494977.pdf?src-supplier=Digi-Key; ComponentLink4Description: https://datasheet.ciiva.com/2494/dcrcwe3-2494977.pdf?src-supplier=Digi-Key; ComponentLink5URL: https://datasheet.ciiva.com/3256/dcrcwe3-3256517.pdf?src-supplier=Avnet; ComponentLink5Description: https://datasheet.ciiva.com/3256/dcrcwe3-3256517.pdf?src-supplier=Avnet; ComponentLink6URL: https://datasheet.ciiva.com/16763/70201119-16763237.pdf?src-supplier=Allied+Electronics; ComponentLink6Description: https://datasheet.ciiva.com/16763/70201119-16763237.pdf?src-supplier=Allied+Electronics; ComponentLink7URL: https://datasheet.ciiva.com/8336/dcrcwe3-8336730.pdf?src-supplier=Avnet; ComponentLink7Description: https://datasheet.ciiva.com/8336/dcrcwe3-8336730.pdf?src-supplier=Avnet; ComponentLink8URL: https://datasheet.ciiva.com/7743/125364-7743643.pdf?src-supplier=Element14; ComponentLink8Description: https://datasheet.ciiva.com/7743/125364-7743643.pdf?src-supplier=Element14; ComponentLink9URL: https://datasheet.ciiva.com/2494/dcrcwe3-2494975.pdf?src-supplier=Digi-Key; ComponentLink9Description: https://datasheet.ciiva.com/2494/dcrcwe3-2494975.pdf?src-supplier=Digi-Key; ComponentLink10URL: https://datasheet.ciiva.com/7671/1697337-7671599.pdf?src-supplier=Element14; ComponentLink10Description: https://datasheet.ciiva.com/7671/1697337-7671599.pdf?src-supplier=Element14; ComponentLink11URL: https://datasheet.ciiva.com/22702/1697337-22702879.pdf?src-supplier=Element14; ComponentLink11Description: https://datasheet.ciiva.com/22702/1697337-22702879.pdf?src-supplier=Element14; Parameter 1: *; JLCPCB Part #: C25792
R52 R71 = CMP-2100-03662-1: ±1% 100kΩ ±100ppm/℃ 0.1W 0603 Chip Resistor - Surface Mount ROHS; Manufacturer: Yageo; Manufacturer Part Number: RC0603FR-07100KL; Power Rating: 100mW; Voltage Rating: 50V; Resistance: 100KOhm; Temperature Coefficient: 100ppm/degreesC; Working Voltage: 75V; Datasheet Version: Rev. 5, 10/2016; Height: 0.45mm; Lead Free: LeadFree; Manufacturer URL: http://www.yageo.com/; Package Reference: 0603; Depth: 0.8mm; RoHSCompliant: true; Composition: ThickFilm; Military Standard: Not; Case/Package: 0603; Packaging: TapeandReel; Case Code (Imperial): 0603; Voltage Rating (DC): 50V; Case Code (Metric): 1608; Tolerance: 1%; Termination: SMD/SMT; Min Operating Temperature: -55degC; Number of Pins: 2; Length: 1.6mm; Width: 0.8mm; Datasheet URL: http://www.yageo.com/NewPortal/yageodocoutput?fileName=/pdf/R-Chip/PYu-RC_Group_51_RoHS_L_5.pdf; Package Description: 2-Pin Surface Mount Device, Body 1.6 x 0.8 mm; Max Operating Temperature: 155degC; REACH SVHC: NoSVHC; Supplier 1: Digi-Key; Supplier Part Number 1: 311-100KHRCT-ND; RoHS: Yes; Category: Chip SMD Resistors; Stock 1: 19283456; Pricing 1: 1=0.10000, 10=0.02400, 100=0.00970, 1000=0.00436, 2500=0.00378 (USD); Series: RC; Max Power Dissipation: 100mW; Resistor Type: Thick Film; Number of Terminations: 2; Resistance Tolerance: 1%; Features: Moisture Resistant; Construction: Rectangular; Technology: THICK FILM; RoHS Compliant: Yes; ComponentLink1URL: https://datasheet.ciiva.com/11808/0900766b80f96399-11808107.pdf?src-supplier=RSComponents; ComponentLink1Description: https://datasheet.ciiva.com/11808/0900766b80f96399-11808107.pdf?src-supplier=RSComponents; ComponentLink2URL: https://datasheet.ciiva.com/7983/443971-7983593.pdf?src-supplier=Element14; ComponentLink2Description: https://datasheet.ciiva.com/7983/443971-7983593.pdf?src-supplier=Element14; ComponentLink3URL: https://datasheet.ciiva.com/46440/1868787-46440889.pdf?src-supplier=Element14; ComponentLink3Description: https://datasheet.ciiva.com/46440/1868787-46440889.pdf?src-supplier=Element14; ComponentLink4URL: https://datasheet.ciiva.com/7746/1738695-7746234.pdf?src-supplier=Element14; ComponentLink4Description: https://datasheet.ciiva.com/7746/1738695-7746234.pdf?src-supplier=Element14; ComponentLink5URL: https://datasheet.ciiva.com/7746/1738695-7746235.pdf?src-supplier=Element14; ComponentLink5Description: https://datasheet.ciiva.com/7746/1738695-7746235.pdf?src-supplier=Element14; ComponentLink6URL: https://datasheet.ciiva.com/22747/443971-22747516.pdf?src-supplier=Element14; ComponentLink6Description: https://datasheet.ciiva.com/22747/443971-22747516.pdf?src-supplier=Element14; Parameter 1: *; JLCPCB Part #: C25803
R54 = CMP-2100-03667-1: Chip Resistor, 0 Ohm, +/- 5%, 0.1 W, -55 to 155 degC, 0603 (1608 Metric), RoHS, Tape and Reel; Manufacturer: Yageo; Manufacturer Part Number: RC0603JR-070RL; Temperature Coefficient: 200ppm/degreesC; Voltage Rating: 50V; Power Rating: 100mW; Resistance: 0mOhm; Width: 0.8mm; Max Operating Temperature: 155degC; Tolerance: 5%; Package Reference: 0603; Height: 0.45mm; Depth: 0.8mm; Package Description: 2-Pin Surface Mount Device, Body 1.6 x 0.8 mm; Termination: SMD/SMT; Package Quantity: 5000; Case/Package: 0603; Case Code (Imperial): 0603; Radiation Hardening: No; Number of Pins: 2; Length: 1.6mm; Lead Free: LeadFree; Voltage Rating (DC): 50V; Military Standard: Not; Datasheet URL: http://www.yageo.com/NewPortal/yageodocoutput?fileName=/pdf/R-Chip/PYu-RC_Group_51_RoHS_L_5.pdf; Manufacturer URL: http://www.yageo.com/; Packaging: TapeandReel; Case Code (Metric): 1608; Min Operating Temperature: -55degC; Composition: ThickFilm; RoHSCompliant: true; Contact Plating: Tin; Datasheet Version: Rev. 5, 10/2016; REACH SVHC: NoSVHC; Supplier 1: Digi-Key; Supplier Part Number 1: 311-0.0GRCT-ND; RoHS: Yes; Category: Chip SMD Resistors; Stock 1: 3784489; Pricing 1: 1=0.10000, 10=0.01700, 25=0.01240, 50=0.00940, 100=0.00700, 250=0.00532, 500=0.00424, 1000=0.00313 (USD); Size Code: 0603; Resistor Type: Thick Film; Series: RC; Max Power Dissipation: 100mW; Construction: Rectangular; Number of Terminations: 2; Features: Moisture Resistant; Technology: THICK FILM; Resistance Tolerance: 5%; RoHS Compliant: Yes; ComponentLink1URL: https://datasheet.ciiva.com/11808/pyu-r-int-6-11808700.pdf?src-supplier=RSComponents; ComponentLink1Description: https://datasheet.ciiva.com/11808/pyu-r-int-6-11808700.pdf?src-supplier=RSComponents; ComponentLink2URL: https://datasheet.ciiva.com/22747/443971-22747530.pdf?src-supplier=Element14; ComponentLink2Description: https://datasheet.ciiva.com/22747/443971-22747530.pdf?src-supplier=Element14; ComponentLink3URL: https://datasheet.ciiva.com/12555/rc0603-272842-12555254.pdf?src-supplier=Mouser; ComponentLink3Description: https://datasheet.ciiva.com/12555/rc0603-272842-12555254.pdf?src-supplier=Mouser; ComponentLink4URL: https://datasheet.ciiva.com/7746/1738695-7746421.pdf?src-supplier=Element14; ComponentLink4Description: https://datasheet.ciiva.com/7746/1738695-7746421.pdf?src-supplier=Element14; ComponentLink5URL: https://datasheet.ciiva.com/7746/1738695-7746422.pdf?src-supplier=Element14; ComponentLink5Description: https://datasheet.ciiva.com/7746/1738695-7746422.pdf?src-supplier=Element14; ComponentLink6URL: https://datasheet.ciiva.com/8883/pyu-rc0603-51-rohs-l-4-8883045.pdf?src-supplier=Avnet; ComponentLink6Description: https://datasheet.ciiva.com/8883/pyu-rc0603-51-rohs-l-4-8883045.pdf?src-supplier=Avnet; ComponentLink7URL: https://datasheet.ciiva.com/15189/getdatasheetpartid-329462-15189845.pdf?src-supplier=Verical; ComponentLink7Description: https://datasheet.ciiva.com/15189/getdatasheetpartid-329462-15189845.pdf?src-supplier=Verical; Parameter 1: *; JLCPCB Part #: *
R67 = CMP-2100-03662-1: 36kΩ ±1% ±100ppm/℃ 0.1W 0603 Chip Resistor - Surface Mount ROHS; Manufacturer: Yageo; Manufacturer Part Number: RC0603FR-07100KL; Power Rating: 100mW; Voltage Rating: 50V; Resistance: 100KOhm; Temperature Coefficient: 100ppm/degreesC; Working Voltage: 75V; Datasheet Version: Rev. 5, 10/2016; Height: 0.45mm; Lead Free: LeadFree; Manufacturer URL: http://www.yageo.com/; Package Reference: 0603; Depth: 0.8mm; RoHSCompliant: true; Composition: ThickFilm; Military Standard: Not; Case/Package: 0603; Packaging: TapeandReel; Case Code (Imperial): 0603; Voltage Rating (DC): 50V; Case Code (Metric): 1608; Tolerance: 1%; Termination: SMD/SMT; Min Operating Temperature: -55degC; Number of Pins: 2; Length: 1.6mm; Width: 0.8mm; Datasheet URL: http://www.yageo.com/NewPortal/yageodocoutput?fileName=/pdf/R-Chip/PYu-RC_Group_51_RoHS_L_5.pdf; Package Description: 2-Pin Surface Mount Device, Body 1.6 x 0.8 mm; Max Operating Temperature: 155degC; REACH SVHC: NoSVHC; Supplier 1: Digi-Key; Supplier Part Number 1: 311-100KHRCT-ND; RoHS: Yes; Category: Chip SMD Resistors; Stock 1: 19283456; Pricing 1: 1=0.10000, 10=0.02400, 100=0.00970, 1000=0.00436, 2500=0.00378 (USD); Series: RC; Max Power Dissipation: 100mW; Resistor Type: Thick Film; Number of Terminations: 2; Resistance Tolerance: 1%; Features: Moisture Resistant; Construction: Rectangular; Technology: THICK FILM; RoHS Compliant: Yes; ComponentLink1URL: https://datasheet.ciiva.com/11808/0900766b80f96399-11808107.pdf?src-supplier=RSComponents; ComponentLink1Description: https://datasheet.ciiva.com/11808/0900766b80f96399-11808107.pdf?src-supplier=RSComponents; ComponentLink2URL: https://datasheet.ciiva.com/7983/443971-7983593.pdf?src-supplier=Element14; ComponentLink2Description: https://datasheet.ciiva.com/7983/443971-7983593.pdf?src-supplier=Element14; ComponentLink3URL: https://datasheet.ciiva.com/46440/1868787-46440889.pdf?src-supplier=Element14; ComponentLink3Description: https://datasheet.ciiva.com/46440/1868787-46440889.pdf?src-supplier=Element14; ComponentLink4URL: https://datasheet.ciiva.com/7746/1738695-7746234.pdf?src-supplier=Element14; ComponentLink4Description: https://datasheet.ciiva.com/7746/1738695-7746234.pdf?src-supplier=Element14; ComponentLink5URL: https://datasheet.ciiva.com/7746/1738695-7746235.pdf?src-supplier=Element14; ComponentLink5Description: https://datasheet.ciiva.com/7746/1738695-7746235.pdf?src-supplier=Element14; ComponentLink6URL: https://datasheet.ciiva.com/22747/443971-22747516.pdf?src-supplier=Element14; ComponentLink6Description: https://datasheet.ciiva.com/22747/443971-22747516.pdf?src-supplier=Element14; Parameter 1: *; JLCPCB Part #: C23147